# EasyEDA Pro project examples.epro, schematic Schematic3
Create Date: 2026-03-05; Page Name: P1; Project Name: EdaCopilotExamples; Schematic Name: Schematic3; Update Date: 2026-03-05; Company: EasyEDA.com; Page Size: A4; Version: V1.0
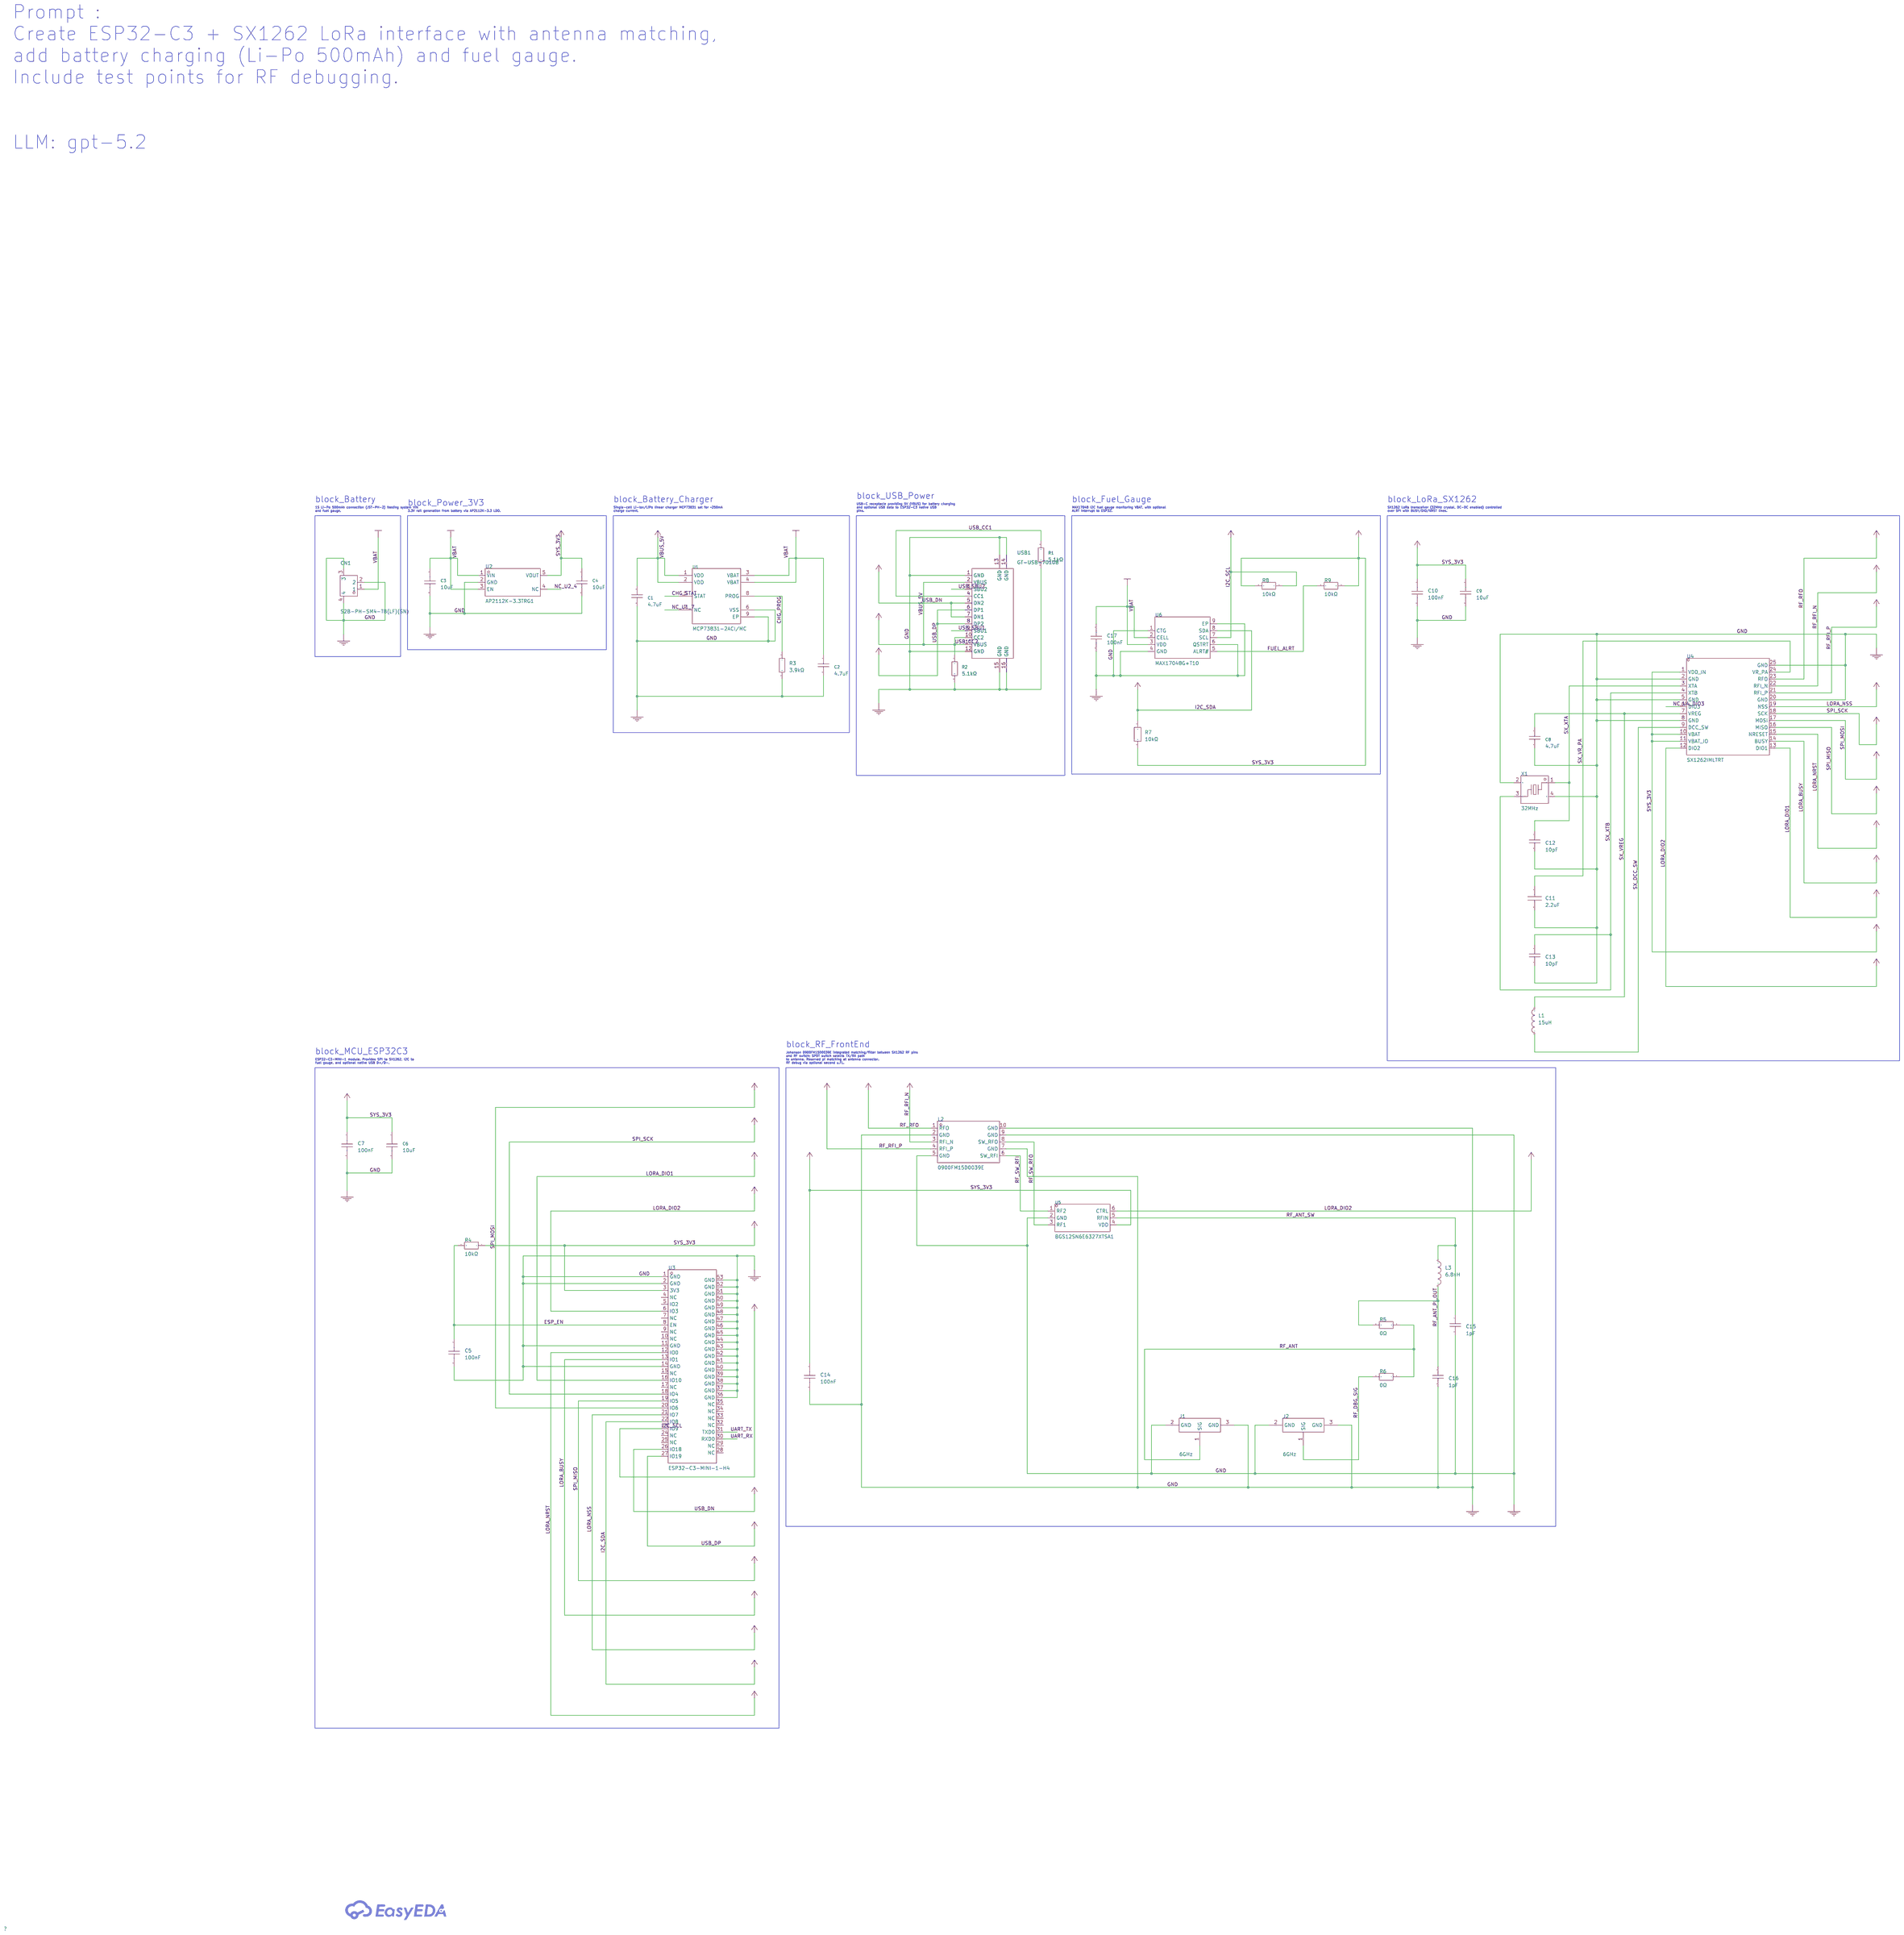
[diagram p2: schematic sheet]

## Parts
C1  4.7uF  [C0603]
C2  4.7uF  [C0603]
C3  10uF  [C0603]
C4  10uF  [C0603]
C5  100nF  [C0402]
C6  10uF  [C0603]
C7  100nF  [C0402]
C8  4.7uF  [C0603]
C9  10uF  [C0603]
C10  100nF  [C0402]
C11  2.2uF  [C0402]
C12  10pF  [C0603]
C13  10pF  [C0603]
C14  100nF  [C0402]
C15  1pF  [C0402]
C16  1pF  [C0402]
C17  100nF  [C0402]
CN1  S2B-PH-SM4-TB(LF)(SN)  [CONN-SMD_P2.00_S2B-PH-SM4-TB-LF-SN]
J1  6GHz  [RF-SMD_FRF05002-JSS103M]
J2  6GHz  [RF-SMD_FRF05002-JSS103M]
L1  15uH  [IND-SMD_L7.0-W6.6_FXL0630]
L2  0900FM15D0039E  [FILTER-SMD_10P-L2.0-W1.3-BL]
L3  6.8nH  [L0402-RD]
R1  5.1kΩ  [R0603]
R2  5.1kΩ  [R0603]
R3  3.9kΩ  [R0603]
R4  10kΩ  [R0603]
R5  0Ω  [RES-SMD_L8.2-W1.5-P8.2]
R6  0Ω  [RES-SMD_L8.2-W1.5-P8.2]
R7  10kΩ  [R0603]
R8  10kΩ  [R0603]
R9  10kΩ  [R0603]
U1  MCP73831-2ACI/MC  [TDFN-8_L3.0-W2.0-P0.50-BL-EP1.6]
U2  AP2112K-3.3TRG1  [SOT-25-5_L2.9-W1.6-P0.95-LS2.8-BL]
U3  ESP32-C3-MINI-1-H4  [WIFIM-SMD_ESP32-C3-MINI-1]
U4  SX1262IMLTRT  [QFN-24_L4.0-W4.0-P0.50-BL-EP2.6]
U5  BGS12SN6E6327XTSA1  [TSNP-6_L1.1-W0.7-P0.40-BL]
U6  MAX17048G+T10  [TDFN-8_L2.0-W2.0-P0.50-BL-EP1.2]
USB1  GT-USB-7010B  [USB-SMD_GT-USB-7010B]
X1  32MHz  [CRYSTAL-SMD_4P-L2.0-W1.6-BL]

## Library data of the parts
C1 C2 C8 = CL10A475KP8NNNC: Capacitance:4.7uF Tolerance:±10% Tolerance:±10% Voltage Rating:10V Temperature Coefficient:X5R; LCSC Part Name: 4.7uF ±10% 10V; Supplier Part: C1705; Manufacturer: SAMSUNG(三星); Supplier Footprint: 0603; JLCPCB Part Class: Extended Part; Datasheet: https://item.szlcsc.com/datasheet/CL10A475KP8NNNC/2057.html; Supplier: LCSC; Tolerance: ±10%; Voltage Rating: 10V; Temperature Coefficient: X5R; supplier: LCSC; supplierId: C1705
C3 C4 C6 C9 = CL10A106MA8NRNC: Capacitance:10uF Tolerance:±20% Tolerance:±20% Voltage Rating:25V Temperature Coefficient:X5R; LCSC Part Name: 10uF ±20% 25V; Supplier Part: C96446; Manufacturer: SAMSUNG(三星); Supplier Footprint: 0603; JLCPCB Part Class: Basic Part; Datasheet: https://item.szlcsc.com/datasheet/CL10A106MA8NRNC/97651.html; Supplier: LCSC; Tolerance: ±20%; Voltage Rating: 25V; Temperature Coefficient: X5R; supplier: LCSC; supplierId: C96446
C5 C7 C10 C14 C17 = CL05B104KB54PNC: Capacitance:100nF Tolerance:±10% Tolerance:±10% Voltage Rating:50V Temperature Coefficient:X7R; LCSC Part Name: 100nF ±10% 50V; Supplier Part: C307331; Manufacturer: SAMSUNG(三星); Supplier Footprint: 0402; JLCPCB Part Class: Basic Part; Datasheet: https://item.szlcsc.com/datasheet/CL05B104KB54PNC/291005.html; Supplier: LCSC; Tolerance: ±10%; Voltage Rating: 50V; Temperature Coefficient: X7R; supplier: LCSC; supplierId: C307331
C11 = CL05A225MQ5NSNC: Capacitance:2.2uF Tolerance:±20% Tolerance:±20% Voltage Rating:6.3V Temperature Coefficient:X5R; LCSC Part Name: 2.2uF ±20% 6.3V; Supplier Part: C12530; Manufacturer: SAMSUNG(三星); Supplier Footprint: 0402; JLCPCB Part Class: Basic Part; Datasheet: https://item.szlcsc.com/datasheet/CL05A225MQ5NSNC/13164.html; Supplier: LCSC; Tolerance: ±20%; Voltage Rating: 6.3V; Temperature Coefficient: X5R; supplier: LCSC; supplierId: C12530
C12 C13 = CL10C100JB8NNNC: Capacitance:10pF Tolerance:±5% Tolerance:±5% Voltage Rating:50V Temperature Coefficient:C0G; LCSC Part Name: 10pF ±5% 50V; Supplier Part: C1634; Manufacturer: SAMSUNG(三星); Supplier Footprint: 0603; JLCPCB Part Class: Basic Part; Datasheet: https://item.szlcsc.com/datasheet/CL10C100JB8NNNC/1986.html; Supplier: LCSC; Tolerance: ±5%; Voltage Rating: 50V; Temperature Coefficient: C0G; supplier: LCSC; supplierId: C1634
C15 C16 = 0402CG1R0C500NT: Capacitance:1pF Voltage Rating:50V Temperature Coefficient:C0G; LCSC Part Name: ±0.25pF 1pF 50V; Supplier Part: C1550; Manufacturer: FH(风华); Supplier Footprint: 0402; JLCPCB Part Class: Extended Part; Datasheet: https://item.szlcsc.com/datasheet/0402CG1R0C500NT/1902.html; Supplier: LCSC; Voltage Rating: 50V; Temperature Coefficient: C0G; supplier: LCSC; supplierId: C1550
CN1 = S2B-PH-SM4-TB(LF)(SN): Pins Structure:1x2P Pitch:2mm Mounting Style:Horizontal attachment Reference Series:PH Number of Pins:2P Number of Rows:1 Number of PINs Per Row:2 Row Spacing:- Current Rating (Max):2A Contact Material:Copper alloy Contact Plating:Tin Operating Temperatur; LCSC Part Name: 1x2P 间距:2mm 卧贴 系列:PH; Supplier Part: C295747; Manufacturer: JST; Supplier Footprint: SMD,P=2mm,卧贴; JLCPCB Part Class: Extended Part; Datasheet: https://atta.szlcsc.com/upload/public/pdf/source/20210203/C295747_344B2E64535E381E727D98C302AB61C7.pdf; Supplier: LCSC; Pins Structure: 1x2P; Pitch: 2mm; Mounting Style: Horizontal attachment; Reference Series: PH; Number of Pins: 2P; Number of Rows: 1; Number of PINs Per Row: 2; Current Rating (Max): 2A; Contact Material: Copper alloy; Contact Plating: Tin; Operating Temperature Range: -25℃~+85℃; Rated Voltage (Max): 100V; Plastic Material: PA; Flame Retardant Rating: UL94V-0; Supplementary Features: Auxiliary soldering legs; Colour: Beige; Z-Height of the Board: 5.5mm; X-Length of Bottom Edge on Board (Spacing Line): 7.9mm; Y-Width of Bottom Edge on Board: 8.6mm; supplier: LCSC; supplierId: C295747
J1 J2 = U.FL-R-SMT-1(80)_C88374: Connector Type:Board Side Interface:Male Pin Number of Ports:1 Interface Diameter:2mm Interface Length/Height:1.25mm Frequency:6GHz RF Series:IPEX Impedance:50Ω Style:- Operating Temperature Range:-40℃~+90℃ Operating Temperature Range:-40℃~+90℃; LCSC Part Name: IPEX 内针; Supplier Part: C88374; Manufacturer: HRS(广濑); Manufacturer Part: U.FL-R-SMT-1(80); Supplier Footprint: SMD; JLCPCB Part Class: Extended Part; Datasheet: https://item.szlcsc.com/datasheet/U.FL-R-SMT-1(80)/89553.html; Supplier: LCSC; Connector Type: Board Side; Interface: Male Pin; Number of Ports: 1; Interface Diameter: 2mm; Interface Length/Height: 1.25mm; RF Series: IPEX; Impedance: 50Ω; Operating Temperature Range: -40℃~+90℃; supplier: LCSC; supplierId: C88374
L1 = FXL0630-150-M: Inductance:15uH Tolerance:±20% Tolerance:±20% Current Rating:3A Current - Saturation(Isat):4A DC Resistance(DCR):115mΩ Type:Molded Inductor Ratings:-; LCSC Part Name: 15uH ±20%; Supplier Part: C177243; Manufacturer: cjiang(长江微电); Supplier Footprint: SMD,7x6.6mm; JLCPCB Part Class: Extended Part; Datasheet: https://item.szlcsc.com/datasheet/FXL0630-150-M/188635.html; Supplier: LCSC; Tolerance: ±20%; Current Rating: 3A; Current - Saturation(Isat): 4A; DC Resistance(DCR): 115mΩ; Type: Molded Inductor; supplier: LCSC; supplierId: C177243
L2 = 0900FM15D0039E: Frequency - Center:866MHz；915Hz Bandwidth:- Bandwidth:- Insertion Loss:0.8dB Impedance:50Ω Operating Temperature:-40℃~+85℃ Operating Temperature:-40℃~+85℃; Supplier Part: C1513363; Manufacturer: JOHANSON(约翰逊); Supplier Footprint: SMD-10P,2x1.2mm; JLCPCB Part Class: Extended Part; Datasheet: https://item.szlcsc.com/datasheet/0900FM15D0039E/1604159.html; Supplier: LCSC; Frequency - Center: 866MHz；915Hz; Insertion Loss: 0.8dB; Impedance: 50Ω; Operating Temperature: -40℃~+85℃; supplier: LCSC; supplierId: C1513363
L3 = LQG15HS6N8J02D: Inductance:6.8nH Tolerance:±5% Tolerance:±5% Current Rating:600mA Current - Saturation (Isat):- DC Resistance(DCR):220mΩ Q @ Frequency:8@100MHz Frequency - Self Resonant:4.5GHz Ratings:-; LCSC Part Name: 6.8nH ±5%; Supplier Part: C77110; Manufacturer: muRata(村田); Supplier Footprint: 0402; JLCPCB Part Class: Extended Part; Datasheet: https://item.szlcsc.com/datasheet/LQG15HS6N8J02D/78237.html; Supplier: LCSC; Tolerance: ±5%; Current Rating: 600mA; DC Resistance(DCR): 220mΩ; Q @ Frequency: 8@100MHz; Frequency - Self Resonant: 4.5GHz; supplier: LCSC; supplierId: C77110
R1 R2 = 0603WAJ0512T5E: Type:Thick Film Resistor Resistance:5.1kΩ Tolerance:±5% Tolerance:±5% Power(Watts):100mW Voltage-Supply(Max):75V Temperature Coefficient:±100ppm/℃ Temperature Coefficient:±100ppm/℃ Operating Temperature:-55℃~+155℃ Operating Temperature:-55℃~+155℃; LCSC Part Name: 5.1kΩ ±5% 100mW 厚膜电阻; Supplier Part: C26000; Manufacturer: UNI-ROYAL(厚声); Supplier Footprint: 0603; JLCPCB Part Class: Extended Part; Datasheet: https://item.szlcsc.com/datasheet/0603WAJ0512T5E/26743.html; Supplier: LCSC; Type: Thick Film Resistor; Tolerance: ±5%; Power(Watts): 100mW; Voltage-Supply(Max): 75V; Temperature Coefficient: ±100ppm/℃; Operating Temperature: -55℃~+155℃; supplier: LCSC; supplierId: C26000
R3 = 0603WAF3901T5E: Type:Thick Film Resistor Resistance:3.9kΩ Tolerance:±1% Tolerance:±1% Power(Watts):100mW Voltage-Supply(Max):75V Temperature Coefficient:±100ppm/℃ Temperature Coefficient:±100ppm/℃ Operating Temperature:-55℃~+155℃ Operating Temperature:-55℃~+155℃; LCSC Part Name: 3.9kΩ ±1% 100mW 厚膜电阻; Supplier Part: C23018; Manufacturer: UNI-ROYAL(厚声); Supplier Footprint: 0603; JLCPCB Part Class: Basic Part; Datasheet: https://item.szlcsc.com/datasheet/0603WAF3901T5E/23745.html; Supplier: LCSC; Type: Thick Film Resistor; Tolerance: ±1%; Power(Watts): 100mW; Voltage-Supply(Max): 75V; Temperature Coefficient: ±100ppm/℃; Operating Temperature: -55℃~+155℃; supplier: LCSC; supplierId: C23018
R4 R7-R9 = FRC0603J103 TS: Type:Thick Film Resistor Resistance:10kΩ Tolerance:±5% Tolerance:±5% Power(Watts):100mW Voltage-Supply(Max):75V Temperature Coefficient:±100ppm/℃ Temperature Coefficient:±100ppm/℃ Operating Temperature:-55℃~+155℃ Operating Temperature:-55℃~+155℃; LCSC Part Name: 10kΩ ±5% 100mW 厚膜电阻; Supplier Part: C2930027; Manufacturer: FOJAN(富捷); Supplier Footprint: 0603; JLCPCB Part Class: Extended Part; Datasheet: https://item.szlcsc.com/datasheet/FRC0603J103%2520TS/3266960.html; Supplier: LCSC; Type: Thick Film Resistor; Tolerance: ±5%; Power(Watts): 100mW; Voltage-Supply(Max): 75V; Temperature Coefficient: ±100ppm/℃; Operating Temperature: -55℃~+155℃; supplier: LCSC; supplierId: C2930027
R5 R6 = HoTFe-8.2D-0R: Type:Jumping wire resistance Resistance:0Ω Tolerance:- Tolerance:- Power(Watts):- Mounting Type:Patch; Supplier Part: C5127897; Manufacturer: Milliohm(毫欧); Supplier Footprint: SMD,1.5x8.2mm; JLCPCB Part Class: Extended Part; Datasheet: https://atta.szlcsc.com/upload/public/pdf/source/20220914/D5A04B7AD81E1FABEEEF624A685A0A87.pdf; Supplier: LCSC; Type: Jumping wire resistance; Mounting Type: Patch; supplier: LCSC; supplierId: C5127897
U1 = MCP73831-2ACI/MC: The Chip Type:Charging IC Voltage - Supply:3.75V~6V Voltage - Supply:3.75V~6V Charge Current - Max:550mA Charging Saturation Voltage:4.2V Type of Battery:Lithium Battery Number of Cells:1 Number of Cells:1 Operating Temperature:-40℃~+85℃ Operating Tempera; LCSC Part Name: 单节、完全集成式锂离子/锂聚合物充电管理控制器; Supplier Part: C150772; Manufacturer: MICROCHIP(美国微芯); Supplier Footprint: TDFN-8-EP(2x3); JLCPCB Part Class: Extended Part; Datasheet: https://item.szlcsc.com/datasheet/MCP73831-2ACI%252FMC/162112.html; Supplier: LCSC; The Chip Type: Charging IC; Voltage - Supply: 3.75V~6V; Charge Current - Max: 550mA; Charging Saturation Voltage: 4.2V; Type of Battery: Lithium Battery; Number of Cells: 1; Operating Temperature: -40℃~+85℃; Supply Current (Iq): 100nA; supplier: LCSC; supplierId: C150772
U2 = AP2112K-3.3TRG1: Output Type:Fixed Voltage - Supply:6V Output Voltage:3.3V Output Voltage:3.3V Output Current:600mA Power Supply Rejection Ratio (PSRR):65dB@(1kHz) Voltage Dropout:250mV@(600mA) standby current:55uA Noise:50uVrms Features:Enable；Over Temperature Protection; LCSC Part Name: 输入6V 输出3.3V 600mA; Supplier Part: C51118; Manufacturer: DIODES(美台); Supplier Footprint: SOT-25-5; JLCPCB Part Class: Extended Part; Datasheet: https://item.szlcsc.com/datasheet/AP2112K-3.3TRG1/52131.html; Supplier: LCSC; Output Type: Fixed; Voltage - Supply: 6V; Output Voltage: 3.3V; Output Current: 600mA; Power Supply Rejection Ratio (PSRR): 65dB@(1kHz); Voltage Dropout: 250mV@(600mA); standby current: 55uA; Noise: 50uVrms; Features: Enable；Over Temperature Protection；Over Current Protection; Operating Temperature: -40℃~+85℃@(Ta); Output Configuration: Positive; Number of Outputs: 1; supplier: LCSC; supplierId: C51118
U3 = ESP32-C3-MINI-1-H4: Utilized IC / Part:ESP32-C3FH4 Wireless Standard:Bluetooth5.0 Interface Type:I2C；GPIO；UART；SPI；USB；I2S Antenna Type:On-board PCB Antenna Output Power:20.5dBm Output Power:20.5dBm Voltage - Supply:3V~3.6V Voltage - Supply:3V~3.6V Receive  Current:82mA Send; LCSC Part Name: 支持2.4GHz Wi-Fi和蓝牙5的小尺寸模组; Supplier Part: C2935306; Manufacturer: ESPRESSIF(乐鑫); Supplier Footprint: SMD,16.6x13.2mm; JLCPCB Part Class: Extended Part; Datasheet: https://item.szlcsc.com/datasheet/ESP32-C3-MINI-1-H4/3284921.html; Supplier: LCSC; Utilized IC / Part: ESP32-C3FH4; Wireless Standard: Bluetooth5.0; Interface Type: I2C；GPIO；UART；SPI；USB；I2S; Antenna Type: On-board PCB Antenna; Output Power: 20.5dBm; Voltage - Supply: 3V~3.6V; Receive  Current: 82mA; Send  Current: 350mA; Sensitivity: -98dBm; Operating Temperature: -40℃~+105℃; supplier: LCSC; supplierId: C2935306
U4 = SX1262IMLTRT: Frequency Range:- Frequency Range:- Interface:SPI Voltage - Supply:1.8V~3.7V Voltage - Supply:1.8V~3.7V Applications:General-purposeISM Output Power:22dBm Data Rate:300Kbps Current Of Transmitting:32mA Sensitivity:-148dBm Receive Current:4.2mA Operating T; Supplier Part: C191341; Manufacturer: SEMTECH; Supplier Footprint: QFN-24-EP(4x4); JLCPCB Part Class: Extended Part; Datasheet: https://item.szlcsc.com/datasheet/SX1262IMLTRT/216566.html; Supplier: LCSC; Interface: SPI; Voltage - Supply: 1.8V~3.7V; Applications: General-purposeISM; Output Power: 22dBm; Data Rate: 300Kbps; Current Of Transmitting: 32mA; Sensitivity: -148dBm; Receive Current: 4.2mA; Operating Temperature: -40℃~+85℃; supplier: LCSC; supplierId: C191341
U5 = BGS12SN6E6327XTSA1: isolation:47dB Insertion loss:0.9dB Frequency range:50MHz~6GHz Frequency range:50MHz~6GHz Voltage - Supply:1.8V~3.5V Voltage - Supply:1.8V~3.5V operating temperature:-40℃~+85℃ operating temperature:-40℃~+85℃; Supplier Part: C114953; Manufacturer: Infineon(英飞凌); Supplier Footprint: DFN-6(0.7x1.1); JLCPCB Part Class: Extended Part; Datasheet: https://item.szlcsc.com/datasheet/BGS12SN6E6327XTSA1/116197.html; Supplier: LCSC; isolation: 47dB; Insertion loss: 0.9dB; Frequency range: 50MHz~6GHz; Voltage - Supply: 1.8V~3.5V; operating temperature: -40℃~+85℃; supplier: LCSC; supplierId: C114953
U6 = MAX17048G+T10: The Chip Type:Battery monitoring chip Voltage - Supply:2.5V~4.5V Voltage - Supply:2.5V~4.5V Type of Battery:Lithium-ion/Polymer Number of Cells:1 Number of Cells:1 Operating Temperature:-40℃~+85℃ Operating Temperature:-40℃~+85℃; LCSC Part Name: 单节/双节电池电量计使用ModelGauge技术; Supplier Part: C2682616; Manufacturer: ADI(亚德诺)/MAXIM(美信); Supplier Footprint: DFN-8-EP(2x2); JLCPCB Part Class: Extended Part; Datasheet: https://item.szlcsc.com/datasheet/MAX17048G%252BT10/2777647.html; Supplier: LCSC; The Chip Type: Battery monitoring chip; Voltage - Supply: 2.5V~4.5V; Type of Battery: Lithium-ion/Polymer; Number of Cells: 1; Operating Temperature: -40℃~+85℃; supplier: LCSC; supplierId: C2682616
USB1 = GT-USB-7010B: Connector Type:Type-C Protocol Standard:USB 2.0 Gender:Female Mounting Type:Surface Mount, Right Angle Number of Contacts:16P Number of Ports:1 Current Rating-Power:5A Voltage Rating:24V Connect-Disconnect Life:10,000 Cycles Center Height:1.68mm Length:6.; LCSC Part Name: Type-C 母 卧贴; Supplier Part: C2837092; Manufacturer: G-Switch(品赞); Supplier Footprint: SMD; JLCPCB Part Class: Extended Part; Datasheet: https://item.szlcsc.com/datasheet/GT-USB-7010B/3006460.html; Supplier: LCSC; Connector Type: Type-C; Protocol Standard: USB 2.0; Gender: Female; Mounting Type: Surface Mount, Right Angle; Number of Contacts: 16P; Number of Ports: 1; Current Rating-Power: 5A; Voltage Rating: 24V; Connect-Disconnect Life: 10,000 Cycles; Center Height: 1.68mm; Length: 6.5mm; Detection color: Black; Operating Temperature: -40℃~+85℃; supplier: LCSC; supplierId: C2837092
X1 = NX2016SA-32M-EXS00A-CS06465: Frequency:32MHz Load Capacitance:10pF Frequency Stability:- Frequency Stability:- Equivalent Series Resistance(ESR):60Ω Operating Temperature:- Operating Temperature:-; LCSC Part Name: 32MHz 10pF; Supplier Part: C1986260; Manufacturer: NDK; Supplier Footprint: SMD2016-4P; JLCPCB Part Class: Extended Part; Datasheet: https://item.szlcsc.com/datasheet/NX2016SA-32M-EXS00A-CS06465/2077804.html; Supplier: LCSC; Load Capacitance: 10pF; Equivalent Series Resistance(ESR): 60Ω; supplier: LCSC; supplierId: C1986260

## Nets
GND: C1.2 C2.2 C3.2 C4.2 C5.2 C6.2 C7.2 C8.2 C9.2 C10.2 C11.2 C12.2 C13.2 C14.2 C15.2 C16.2 C17.2 CN1.2 CN1.3 CN1.4 J1.2(GND) J1.3(GND) J2.2(GND) J2.3(GND) L2.2(GND) L2.5(GND) L2.7(GND) L2.9(GND) L2.10(GND) R1.2 R2.2 R3.2 U1.6(VSS) U1.9(EP) U2.2(GND) U3.1(GND) U3.2(GND) U3.11(GND) U3.14(GND) U3.36(GND) U3.37(GND) U3.38(GND) U3.39(GND) U3.40(GND) U3.41(GND) U3.42(GND) U3.43(GND) U3.44(GND) U3.45(GND) U3.46(GND) U3.47(GND) U3.48(GND) U3.49(GND) U3.50(GND) U3.51(GND) U3.52(GND) U3.53(GND) U4.2(GND) U4.5(GND) U4.8(GND) U4.20(GND) U4.25(GND) U5.2(GND) U6.1(CTG) U6.4(GND) U6.6(QSTRT) U6.9(EP) USB1.1(GND) USB1.12(GND) USB1.13(GND) USB1.14(GND) USB1.15(GND) USB1.16(GND) X1.2(GND) X1.4(GND)
VBAT: C2.1 C3.1 C17.1 CN1.1 U1.3(VBAT) U1.4(VBAT) U2.1(VIN) U2.3(EN) U6.2(CELL) U6.3(VDD)
VBUS_5V: C1.1 U1.1(VDD) U1.2(VDD) USB1.2(VBUS) USB1.11(VBUS)
CHG_PROG: R3.1 U1.8(PROG)
CHG_STAT: U1.5(STAT)
ESP_EN: C5.1 R4.2 U3.8(EN)
FUEL_ALRT: R9.1 U6.5(ALRT#)
I2C_SCL: R8.1 U3.23(IO9) U6.7(SCL)
I2C_SDA: R7.1 U3.22(IO8) U6.8(SDA)
LORA_BUSY: U3.13(IO1) U4.14(BUSY)
LORA_DIO1: U3.16(IO10) U4.13(DIO1)
LORA_DIO2: U3.6(IO3) U4.12(DIO2) U5.6(CTRL)
LORA_NRST: U3.12(IO0) U4.15(NRESET)
LORA_NSS: U3.21(IO7) U4.19(NSS)
NC_U1_7: U1.7(NC)
NC_U2_4: U2.4(NC)
NC_U4_DIO3: U4.6(DIO3)
RF_ANT: J1.1(SIG) R5.2 R6.1
RF_ANT_PI_OUT: C16.1 L3.2 R5.1
RF_ANT_SW: C15.1 L3.1 U5.5(RFIN)
RF_DBG_SIG: J2.1(SIG) R6.2
RF_RFI_N: L2.3(RFI_N) U4.22(RFI_N)
RF_RFI_P: L2.4(RFI_P) U4.21(RFI_P)
RF_RFO: L2.1(RFO) U4.23(RFO)
RF_SW_RFI: L2.6(SW_RFI) U5.1(RF2)
RF_SW_RFO: L2.8(SW_RFO) U5.3(RF1)
SPI_MISO: U3.19(IO5) U4.16(MISO)
SPI_MOSI: U3.20(IO6) U4.17(MOSI)
SPI_SCK: U3.18(IO4) U4.18(SCK)
SX_DCC_SW: L1.1 U4.9(DCC_SW)
SX_VR_PA: C11.1 U4.24(VR_PA)
SX_VREG: C8.1 L1.2 U4.7(VREG)
SX_XTA: C12.1 U4.3(XTA) X1.1
SX_XTB: C13.1 U4.4(XTB) X1.3
SYS_3V3: C4.1 C6.1 C7.1 C9.1 C10.1 C14.1 R4.1 R7.2 R8.2 R9.2 U2.5(VOUT) U3.3(3V3) U4.1(VDD_IN) U4.10(VBAT) U4.11(VBAT_IO) U5.4(VDD)
UART_RX: U3.30(RXD0)
UART_TX: U3.31(TXD0)
USB_CC1: R1.1 USB1.4(CC1)
USB_CC2: R2.1 USB1.10(CC2)
USB_DN: U3.26(IO18) USB1.5(DN2) USB1.7(DN1)
USB_DP: U3.27(IO19) USB1.6(DP1) USB1.8(DP2)
USB_SBU1: USB1.9(SBU1)
USB_SBU2: USB1.3(SBU2)

Not connected (* = marked no-connect by the designer): U3 4(NC) 5(IO2) 7(NC) 9(NC) 10(NC) 15(NC) 17(NC) 24(NC) 25(NC) 28(NC) 29(NC) 32(NC) 33(NC) 34(NC) 35(NC)

## Notes on the sheet
- Prompt :
  Create ESP32-C3 + SX1262 LoRa interface with antenna matching,
  add battery charging (Li-Po 500mAh) and fuel gauge.
  Include test points for RF debugging.
  LLM: gpt-5.2
- block_USB_Power
- block_Battery
- block_Power_3V3
- block_Battery_Charger
- USB-C receptacle providing 5V (VBUS) for battery charging
  and optional USB data to ESP32-C3 native USB
  pins.
- block_Fuel_Gauge
- block_LoRa_SX1262
- 1S Li-Po 500mAh connection (JST-PH-2) feeding system VIN
  and fuel gauge.
- 3.3V rail generation from battery via AP2112K-3.3 LDO.
- Single-cell Li-Ion/LiPo linear charger MCP73831 set for ~250mA
  charge current.
- MAX17048 I2C fuel gauge monitoring VBAT, with optional
  ALRT interrupt to ESP32.
- SX1262 LoRa transceiver (32MHz crystal, DC-DC enabled) controlled
  over SPI with BUSY/DIO/NRST lines.
- block_RF_FrontEnd
- block_MCU_ESP32C3
- ESP32-C3-MINI-1 module. Provides SPI to SX1262, I2C to
  fuel gauge, and optional native USB D+/D-.
- Johanson 0900FM15D0039E integrated matching/filter between SX1262 RF pins
  and RF switch; SPDT switch selects TX/RX path
  to antenna. Reserved pi matching at antenna connector.
  RF debug via optional second u.FL.
